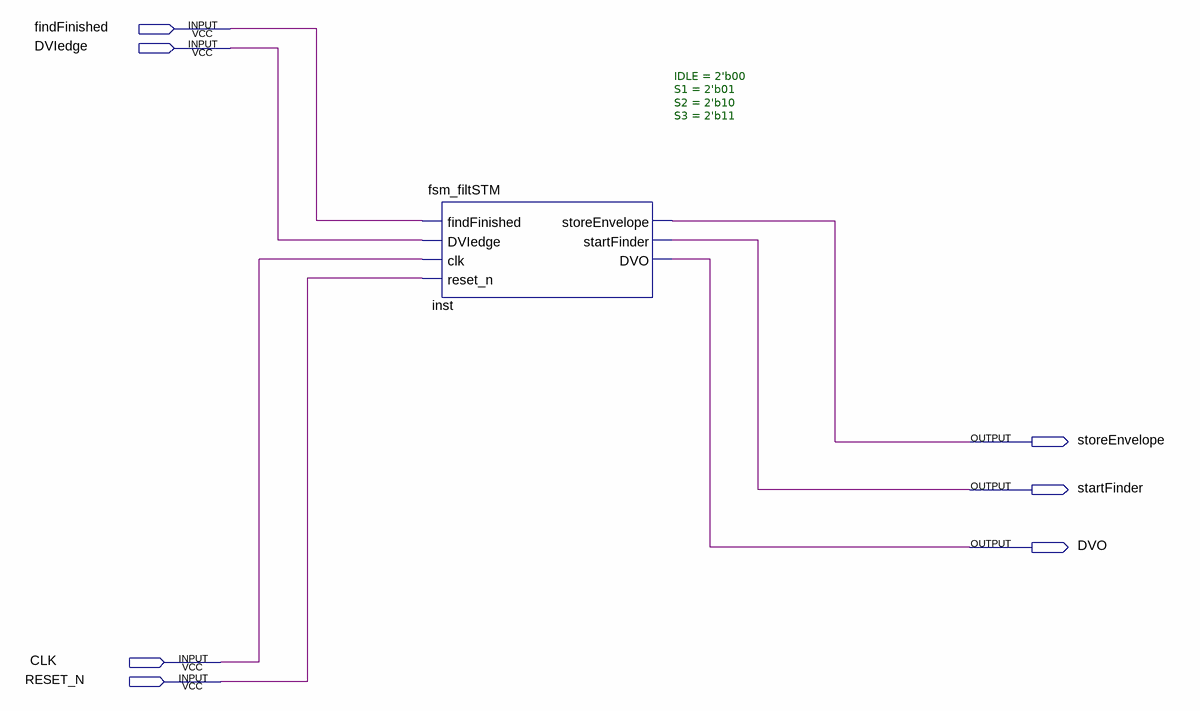
[diagram p0: schematic sheet]
// Quartus schematic factSTM.bdf as structural Verilog: 1 symbols, 7 pins
module factSTM (
  input  findFinished,
  input  DVIedge,
  input  CLK,
  input  RESET_N,
  output storeEnvelope,
  output startFinder,
  output DVO
);

  fsm_filtSTM #(.IDLE(2'b00), .S1(2'b01), .S2(2'b10), .S3(2'b11)) inst (
    .findFinished(findFinished), .DVIedge(DVIedge), .clk(CLK), .reset_n(RESET_N),
    .storeEnvelope(storeEnvelope), .startFinder(startFinder), .DVO(DVO));
endmodule
